# EAGLE design Cargador_Lipo_Sencillo_v10 (EAGLE 6.2)
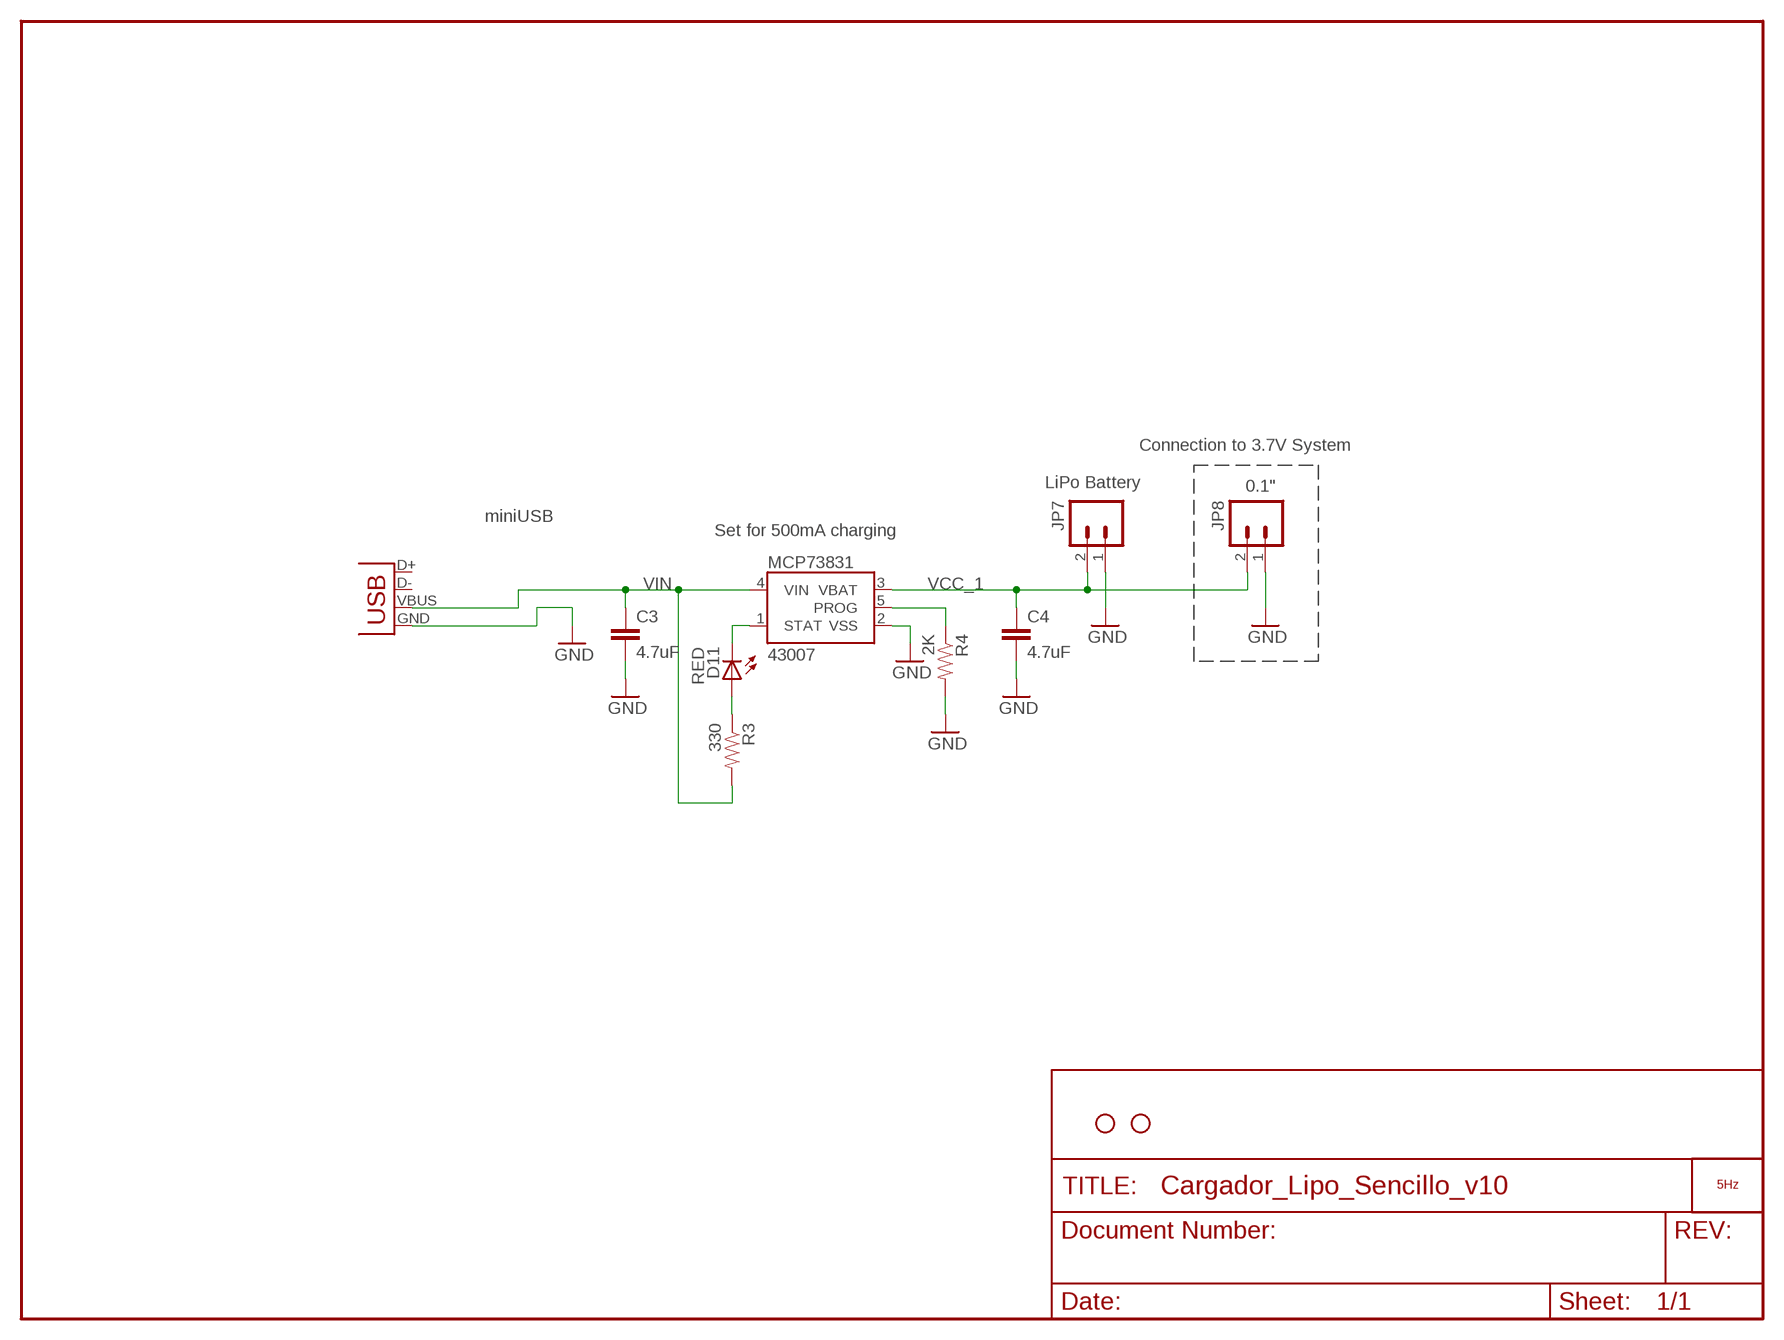
[diagram p0: schematic, sheet 1]

## Parts
C3  4.7uF  CAP0603-CAP  [0603-CAP]
C4  4.7uF  CAP0603-CAP  [0603-CAP]
D11  RED  LED0603  [LED-0603]
JP1  STAND-OFF  [STAND-OFF]
JP2  STAND-OFF  [STAND-OFF]
JP7  LiPo Battery  M02-JST-2MM-SMT  [JST-2-SMD]
JP8  M02POLAR  [MOLEX-1X2]
LOGO1  LOGO_5HZ_H_10MM  [5HZ_LOGO_H_10MM]
MCP73831  43007  MCP73831  [SOT23-5]
R3  330  RESISTOR0603-RES  [0603-RES]
R4  2K  RESISTOR0603-RES  [0603-RES]
X1  USBSMD  [USB-MINIB]

## Nets
GND: C3.2 C4.2 JP7.1 JP8.1 MCP73831.2(VSS) R4.2 X1.GND
N$3: D11.A R3.1
PROG: MCP73831.5(PROG) R4.1
STAT: D11.C MCP73831.1(STAT)
VCC_1: C4.1 JP7.2 JP8.2 MCP73831.3(VBAT)
VIN: C3.1 MCP73831.4(VIN) R3.2 X1.VBUS
Unconnected: X1.D+ X1.D-

## Notes on the sheet
- Connection to 3.7V System
- 0.1"
- miniUSB
- Set for 500mA charging

## Library data of the parts
C3 C4 = SparkFun:CAP: Capacitor Standard 0603 ceramic capacitor, and 0.1" leaded capacitor.
D11 = SparkFun:LED: LEDs Standard schematic elements and footprints for 5mm, 3mm, 1206, and 0603 sized LEDs. 5mm - Spark Fun Electronics SKU : COM-00529 (and others)
JP1 JP2 = SparkFun:STAND-OFF: Stand Off This is the mechanical footprint for a #4 phillips button head screw. Use the keepout ring to avoid running the screw head into surrounding components. SKU : PRT-00447
JP7 JP8 = SparkFun:M02: Header 2 Standard 2-pin 0.1" header. Use with straight break away headers (SKU : PRT-00116), right angle break away headers (PRT-00553), swiss pins (PRT-00743), machine pins (PRT-00117), and female headers (PRT-00115). Molex polarized connector foot print use with SKU : PRT-08233 with associated crimp pins and housings.
LOGO1 = 5hz-electronica:LOGO_5HZ: Logotipo 5Hz "según Pedro"
MCP73831 = SparkFun:MCP73831: Microchip's MCP73831 Miniature single cell, fully integrated Li-Ion, Li-polymer charge management controller http://ww1.microchip.com/downloads/en/DeviceDoc/21984a.pdf
R3 R4 = SparkFun:RESISTOR: Resistor Basic schematic elements and footprints for 0603, 1206, and PTH resistors.
X1 = SparkFun:USB: USB Connectors USB-B-PTH is fully proven SKU : PRT-00139 USB-miniB is fully proven SKU : PRT-00587 USB-A-PCB is untested. USB-A-H is throughly reviewed, but untested. Spark Fun Electronics SKU : PRT-00437 USB-B-SMT is throughly reviewed, but untested. Needs silkscreen touching up. USB-A-S has not been used/tested USB-MB-H has not been used/tested

## Board
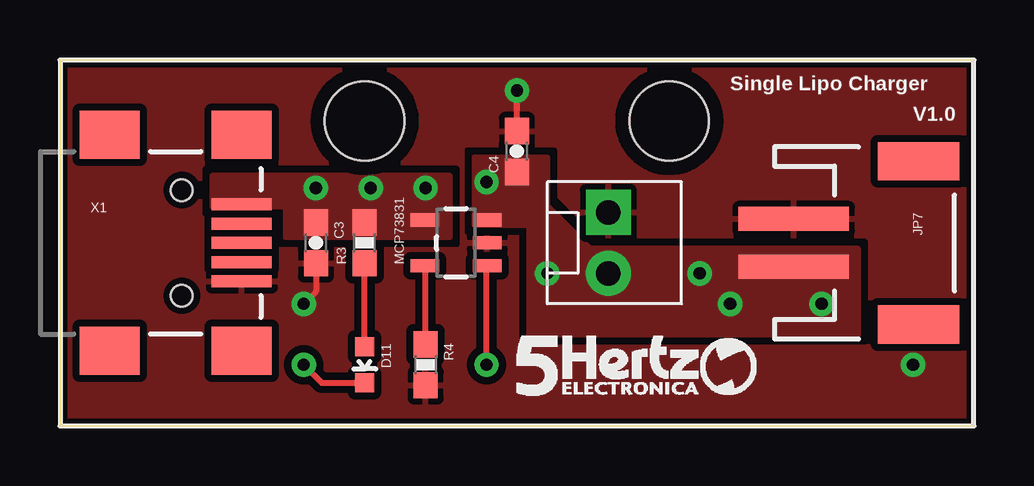
[diagram p1: board, top side]
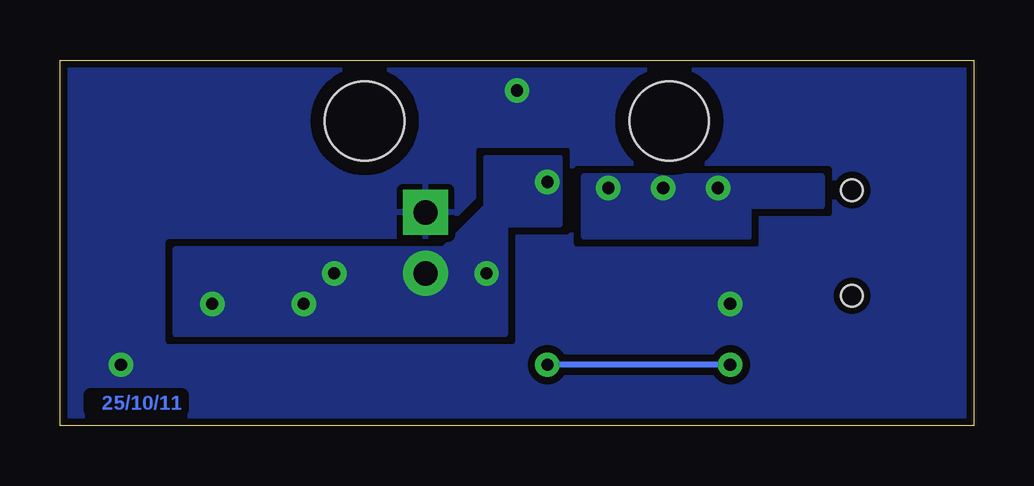
[diagram p2: board, bottom side, seen from below]

Size 38.1 x 15.24 mm. Coordinates in mm from the lower left corner, seen from the top.
Outline: 0,0 38.1,0 38.1,15.24 0,15.24 0,0
Copper layers (1*16): Top 0.035mm / dielectric 1.5mm / Bottom 0.035mm
Design rules: minimum track width 8mil, minimum drill 20mil, track to track 8mil, track to pad 8mil, pad to pad 8mil, via to via 8mil, smd to smd 8mil, copper to edge 10mil, drill to drill 8mil, minimum pad ring 12mil, minimum via ring 10mil, stop-mask expansion 4mil, vias tented up to drill 25mil, thermal gap 10mil

### Footprints (pad centres in the part's own frame; a part is rotated, then mirrored left to right if it is on the bottom)
0603-CAP = smd 1.1 x 1: 1 -0.85,0; 2 0.85,0
LED-0603 = smd 0.8 x 0.8: A 0,-0.75; C 0,0.75
STAND-OFF = hole 3.302: 0,0
JST-2-SMD = smd 1 x 4.6: 1 -1,-3.7; 2 1,-3.7 | smd 1.6 x 3.4: NC1 -3.4,1.5; NC2 3.4,1.5
MOLEX-1X2 = drill 1.016 pad 1.88 square: 1 0,0 | drill 1.016 pad 1.88: 2 2.54,0
SOT23-5 = smd 0.55 x 1.2: 1 -0.95,-1.3; 2 0,-1.3; 3 0.95,-1.3; 4 0.95,1.3; 5 -0.95,1.3
0603-RES = smd 1.1 x 1: 1 -0.85,0; 2 0.85,0
USB-MINIB = smd 2.5 x 0.5: D+ 2.5,0; D- 2.5,0.8; GND 2.5,-1.6; ID 2.5,-0.8; VBUS 2.5,1.6 | smd 2.5 x 2: MTN1 -3,4.5; MTN2 2.5,4.5; MTN3 -3,-4.5; MTN4 2.5,-4.5 | hole 0.9: 0,2.2; 0,-2.2

### Placement (x,y rotation side)
C3  10.67,7.62 270 top
C4  19.05,11.43 90 top
D11  12.7,2.54 180 top
JP1  12.7,12.7 0 top
JP2  25.4,12.7 0 top
JP7  34.29,7.62 270 top
JP8  22.86,8.89 270 top
LOGO1  19.05,1.27 0 top
MCP73831  16.51,7.62 90 top
R3  12.7,7.62 90 top
R4  15.24,2.54 270 top
X1  5.08,7.62 0 top

### Tracks (layer width: path | path; a pad name or v marks a point on that pad's centre or on a via)
GND  (via drill 0.51)
  Top 0.254: C3.2 10.67,5.59 v10.16,5.08 | C4.2 v19.05,13.97
  other vias: 35.56,2.54
  pour Top (isolate 0.305, rank 2): 0,15.24 0,0 38.1,0 38.1,15.24
  pour Bottom (isolate 0.305, rank 2): 0,15.24 0,0 38.1,0 38.1,15.24
N$3
  Top 0.254: D11.A R3.1
PROG
  Top 0.254: R4.1 15.24,6.64 MCP73831.5
STAT  (via drill 0.51)
  Top 0.254: D11.C 10.91,1.79 v10.16,2.54 | v17.78,2.54 17.78,6.64 MCP73831.1
  Bottom 0.254: v10.16,2.54 v17.78,2.54
VCC_1  (via drill 0.51)
  other vias: 17.78,10.16 27.94,5.08 26.67,6.35 20.32,6.35 31.75,5.08
  pour Top (isolate 0.305, no thermals): 17.27,8.38 19.56,8.38 19.56,3.81 33.27,3.81 33.27,7.37 22.1,7.37 20.32,9.14 20.32,11.18 17.27,11.18
  pour Bottom (isolate 0.305, no thermals): 17.27,8.38 19.56,8.38 19.56,3.81 33.27,3.81 33.27,7.37 22.1,7.37 20.32,9.14 20.32,11.18 17.27,11.18
VIN  (via drill 0.51)
  other vias: 10.67,9.91 12.95,9.91 15.24,9.91
  pour Top (isolate 0.305, no thermals): 6.35,10.41 6.35,9.14 9.4,9.14 9.4,7.87 16.26,7.87 16.26,10.41
  pour Bottom (isolate 0.305, no thermals): 6.35,10.41 6.35,9.14 9.4,9.14 9.4,7.87 16.26,7.87 16.26,10.41

### Text on the board
Bottom: 25/10/11
tPlace: Single Lipo Charger | V1.0